# Altium project FMC_SDR_XFE.PrjPcb (part 2 of 3)

## Sheet LTM8056.SchDoc: FMC SDR Frontend
size 420 x 297 mm; CheckedBy: -; CompanyName: CERN; DrawnBy: DrawnBy; Organization: CERN; Address1: European Organization for Nuclear Research; Address2: CH-1211 Genčve 23 - Switzerland; Revision: -; SheetNumber: -; SheetTotal: -; EDA_Number: EDA-XXXXX-VX-X; Projet: -; ModifiedBy: -; CreateDate: XX/XX/XXXX; CheckedDate: -; Title2: PA Main Switching Regulator; DivGrp: TE/MPE; Designer: Designer; ModifiedDate: -
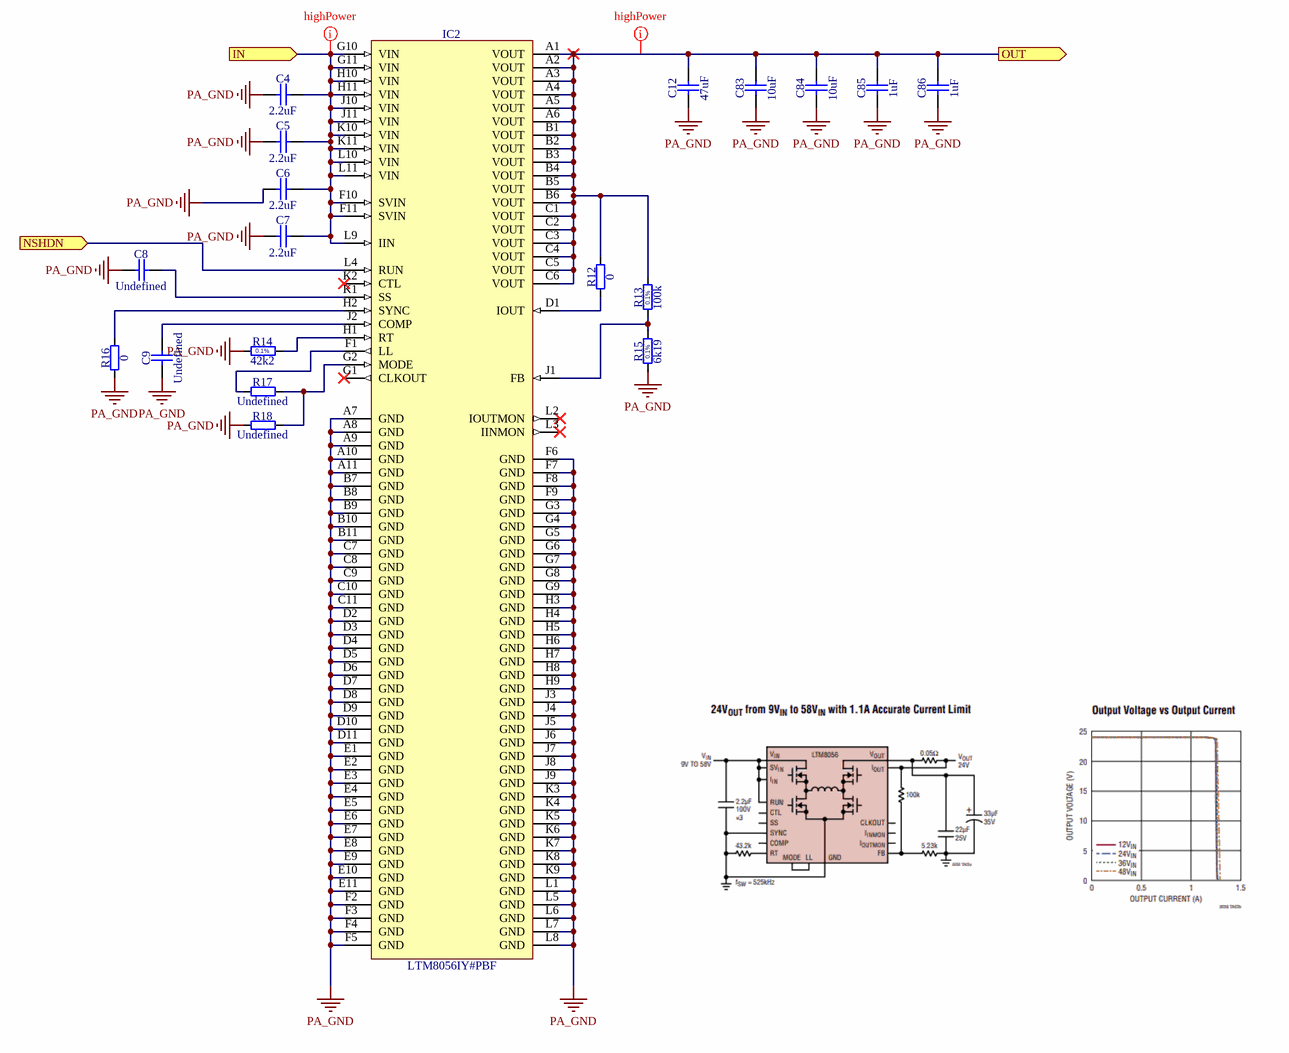
[diagram p2: LTM8056.SchDoc]

### Parts
C4  2.2uF  [CAPC3216X180N]
C5  2.2uF  [CAPC3216X180N]
C6  2.2uF  [CAPC3216X180N]
C7  2.2uF  [CAPC3216X180N]
C8  Undefined  [CAPC1608X90N]
C9  Undefined  [CAPC1608X90N]
C12  47uF  [CAPC_TDK_CKG57N]
C83  10uF  [CAPC3225X280N]
C84  10uF  [CAPC3225X280N]
C85  1uF  [CAPC1608X87N]
C86  1uF  [CAPC1608X87N]
IC2  LTM8056IY#PBF  [BGA121C127P11X11_1500X1500X512]
R12  0  [RESC1608X55N]
R13  100k  [RESC1608X55N]
R14  42k2  [RESC1608X55N]
R15  6k19  [RESC1608X55N]
R16  0  [RESC1608X55N]
R17  Undefined  [RESC1608X55N]
R18  Undefined  [RESC1608X55N]

### Ports
IN (in), NSHDN (in), OUT (out)

### Nets
PA_GND: C4.1 C5.1 C6.1 C7.1 C8.1 C9.1 C12.1 C83.1 C84.1 C85.1 C86.1 IC2.A7(GND) IC2.A8(GND) IC2.A9(GND) IC2.A10(GND) IC2.A11(GND) IC2.B7(GND) IC2.B8(GND) IC2.B9(GND) IC2.B10(GND) IC2.B11(GND) IC2.C7(GND) IC2.C8(GND) IC2.C9(GND) IC2.C10(GND) IC2.C11(GND) IC2.D2(GND) IC2.D3(GND) IC2.D4(GND) IC2.D5(GND) IC2.D6(GND) IC2.D7(GND) IC2.D8(GND) IC2.D9(GND) IC2.D10(GND) IC2.D11(GND) IC2.E1(GND) IC2.E2(GND) IC2.E3(GND) IC2.E4(GND) IC2.E5(GND) IC2.E6(GND) IC2.E7(GND) IC2.E8(GND) IC2.E9(GND) IC2.E10(GND) IC2.E11(GND) IC2.F2(GND) IC2.F3(GND) IC2.F4(GND) IC2.F5(GND) IC2.F6(GND) IC2.F7(GND) IC2.F8(GND) IC2.F9(GND) IC2.G3(GND) IC2.G4(GND) IC2.G5(GND) IC2.G6(GND) IC2.G7(GND) IC2.G8(GND) IC2.G9(GND) IC2.H3(GND) IC2.H4(GND) IC2.H5(GND) IC2.H6(GND) IC2.H7(GND) IC2.H8(GND) IC2.H9(GND) IC2.J3(GND) IC2.J4(GND) IC2.J5(GND) IC2.J6(GND) IC2.J7(GND) IC2.J8(GND) IC2.J9(GND) IC2.K3(GND) IC2.K4(GND) IC2.K5(GND) IC2.K6(GND) IC2.K7(GND) IC2.K8(GND) IC2.K9(GND) IC2.L1(GND) IC2.L5(GND) IC2.L6(GND) IC2.L7(GND) IC2.L8(GND) R14.1 R15.1 R16.1 R18.1
PA_PS_IN: C4.2 C5.2 C6.2 C7.2 IC2.F10(SVIN) IC2.F11(SVIN) IC2.G10(VIN) IC2.G11(VIN) IC2.H10(VIN) IC2.H11(VIN) IC2.J10(VIN) IC2.J11(VIN) IC2.K10(VIN) IC2.K11(VIN) IC2.L9(IIN) IC2.L10(VIN) IC2.L11(VIN) ; port IN
NetC8_2: C8.2 IC2.K1(SS)
NetC9_2: C9.2 IC2.J2(COMP)
NetC12_2: C12.2 C83.2 C84.2 C85.2 C86.2 IC2.A1(VOUT) IC2.A2(VOUT) IC2.A3(VOUT) IC2.A4(VOUT) IC2.A5(VOUT) IC2.A6(VOUT) IC2.B1(VOUT) IC2.B2(VOUT) IC2.B3(VOUT) IC2.B4(VOUT) IC2.B5(VOUT) IC2.B6(VOUT) IC2.C1(VOUT) IC2.C2(VOUT) IC2.C3(VOUT) IC2.C4(VOUT) IC2.C5(VOUT) IC2.C6(VOUT) R12.2 R13.2 ; port OUT
NetIC2_D1: IC2.D1(IOUT) R12.1
NetIC2_F1: IC2.F1(LL) R17.1
NetIC2_G2: IC2.G2(MODE) R17.2 R18.2
NetIC2_H1: IC2.H1(RT) R14.2
NetIC2_H2: IC2.H2(SYNC) R16.2
NetIC2_J1: IC2.J1(FB) R13.1 R15.2
NetIC2_L4: IC2.L4(RUN) ; port NSHDN

Not connected (* = marked no-connect by the designer): IC2 G1(CLKOUT)* K2(CTL)* L2(IOUTMON)* L3(IINMON)*

### Layout directives
net class highPower: NetC12_2, PA_PS_IN

### Notes on the sheet
- Project/Equipment
- Document
- Designer
- Drawn by
- Check.by
- File
- Last Mod.
- Print Date
- Sheet
- Size
- A3
- of
- Rev
- (in symbol R0603_6K19_0.1%_0.063W_10PPM) 0.1%
- (in symbol R0603_42K2_0.1%_0.063W_10PPM) 0.1%
- (in symbol R0603_100K_0.1%_0.063W_10PPM) 0.1%

### Library data of the parts
C4-C7 = CC1206_2.2UF_50V_10%_X7R: Non-polarised capacitor; Part Description: SMD Multilayer Chip Ceramic Capacitor; Manufacturer: GENERIC; Manufacturer1 Part Number: C1206C225K5RACTU; Voltage: 50V; TC: X7R; Tolerance: ±10%; Part Number: CC1206_2.2UF_50V_10%_X7R; Component Kind: Standard; Component Type: Standard; Pin Count: 2; Value: 2.2uF; Status: Preferred; Manufacturer Part Number: CC1206_2.2uF_50V_10%_X7R; Case: 1206; Mounted: Yes; Socket: No; SMD: Yes; Sense: No; Manufacturer1 Example: KEMET; Manufacturer1 ComponentHeight: 1.8mm; HelpURL: \\cern.ch\dfs\Applications\Altium\Datasheets\CC1206_X7R_KEMET.pdf; Author: CERN DEM MR; CreateDate: 06.06.2016; LatestRevisionDate: 06.06.2016
C8 C9 = CC0603_NO-VALUE: Non-polarised capacitor; Part Description: Reserved Footprint For 0603(1608) Chip Ceramic Capacitor; Mounted: No; Part Number: CC0603_NO-VALUE; Component Kind: Standard; Component Type: Standard; Pin Count: 2; Value: Undefined; Status: None; Manufacturer: Undefined; Manufacturer Part Number: CC0603_NO-VALUE; Case: 0603; Socket: No; SMD: Yes; Sense: No; Manufacturer1 ComponentHeight: 0.9mm; HelpURL: Undefined; Author: CERN DEM MR; CreateDate: 22.11.2016; LatestRevisionDate: 22.11.2016
C12 = CC2220_47UF_25V_20%_X7S_TDK_CKG57N: Non-polarised capacitor; Part Description: Multilayer Ceramic Chip Capacitor - Stacked Cap, CKG57N Series; Manufacturer: TDK; Manufacturer Part Number: CKG57NX7S1E476M500JH; Voltage: 25V; TC: X7S; Tolerance: ±20%; Part Number: CC2220_47UF_25V_20%_X7S_TDK_CKG57N; Component Kind: Standard; Component Type: Standard; Pin Count: 2; Value: 47uF; Status: None; Case: 2220; Mounted: Yes; Socket: No; SMD: Yes; Sense: No; ComponentHeight: 5.5mm; HelpURL: \\cern.ch\dfs\Applications\Altium\Datasheets\CC2220_X7S_TDK_CKG.pdf; Author: CERN DEM JLC; CreateDate: 21.10.2014; LatestRevisionDate: 18.12.2017
C83 C84 = CC1210_10UF_50V_10%_X7R_YUDEN_UMK325AB7106KMHP: Non-polarised capacitor; Part Description: SMD Multilayer Chip Ceramic Capacitor (High Dielectric Type) for Automotive / Industrial Applications; Manufacturer: TAIYO YUDEN; Voltage: 50V; TC: X7R; Tolerance: ±10%; Part Number: CC1210_10UF_50V_10%_X7R_YUDEN_UMK325AB7106KMHP; Component Kind: Standard; Component Type: Standard; Pin Count: 2; Value: 10uF; Status: Not Recommended; Manufacturer Part Number: UMK325AB7106KMHP; Case: 1210; Mounted: Yes; Socket: No; SMD: Yes; Sense: No; ComponentHeight: 2.8mm; HelpURL: \\cern.ch\dfs\Applications\Altium\Datasheets\CC1210_TAIYO-YUDEN_UMK325AB7106KMHP.pdf; Author: CERN DEM JLC; CreateDate: 30.11.2016; LatestRevisionDate: 30.12.2015
C85 C86 = CC0603_1UF_50V_10%_X5R: Non-polarised capacitor; Part Description: SMD Multilayer Chip Ceramic Capacitor; Manufacturer: GENERIC; Manufacturer1 Part Number: C1608X5R1H105K080; Voltage: 50V; TC: X5R; Tolerance: ±10%; Part Number: CC0603_1UF_50V_10%_X5R; Component Kind: Standard; Component Type: Standard; Pin Count: 2; Value: 1uF; Status: None; Manufacturer Part Number: CC0603_1UF_50V_10%_X5R; Case: 0603; Mounted: Yes; Socket: No; SMD: Yes; Sense: No; Manufacturer1 Example: TDK; Manufacturer1 ComponentHeight: 0.9mm; HelpURL: \\cern.ch\dfs\Applications\Altium\Datasheets\CC0603_X5R_TDK_C.pdf; Author: CERN DEM JMW; CreateDate: 09.11.2015; LatestRevisionDate: 09.11.2015
IC2 = LTM8056IY#PBF: 58VIN, 48VOUT Buck-Boost µModule Regulator; Manufacturer: LINEAR TECHNOLOGY; PressFit: No; Bonding: No; Part Number: LTM8056IY#PBF; Component Kind: Standard; Component Type: Standard; Device: LTM8056IY#PBF; PackageDescription: BGA,1.27mm Pitch, Square;121 Pin, 11 Columns X 11 Rows, 15.00mm X 15.00mm X 5.12mm H; Part Description: 58VIN, 48VOUT Buck-Boost µModule Regulator; Manufacturer Part Number: LTM8056IY#PBF; Pin Count: 121; Case: BGA121; Mounted: Yes; Socket: No; SMD: Yes; Sense: No; ComponentHeight: 5.12mm; HelpURL: \\cern.ch\dfs\Applications\Altium\Datasheets\LTM8056IY#PBF.pdf; Author: CERN DEM JLC; CreateDate: 08.04.2019; LatestRevisionDate: 08.04.2019
R12 R16 = R0603_0R_JUMPER: Resistor; Part Description: 1A (0.05R Max DC Resistance) Zero Ohm Jumper; Manufacturer: GENERIC; Manufacturer1 Part Number: NRC06Z0; PressFit: No; Part Number: R0603_0R_JUMPER; Component Kind: Standard; Component Type: Standard; Pin Count: 2; Value: 0; Status: Preferred; Manufacturer Part Number: R0603_0R_JUMPER; Case: 0603; Mounted: Yes; Sense: No; Socket: No; SMD: Yes; Manufacturer1 Example: NIC COMPONENT; Manufacturer1 ComponentHeight: 0.55mm; HelpURL: \\cern.ch\dfs\Applications\Altium\Datasheets\R0603_NIC_NRC.pdf; Author: CERN DEM JLC; CreateDate: 03.12.2007; LatestRevisionDate: 13.03.2008
R13 = R0603_100K_0.1%_0.063W_10PPM: Resistor - 0.1%; Part Description: Thin Film Chip Resistor; Manufacturer: GENERIC; Manufacturer1 Part Number: RN73C1J100KBTDF; Power: 0.063W; TC: ±10ppm; PressFit: No; Part Number: R0603_100K_0.1%_0.063W_10PPM; Component Kind: Standard; Component Type: Standard; Pin Count: 2; Value: 100k; Status: Not Recommended; Tolerance: ±0.1%; Manufacturer Part Number: R0603_100K_0.1%_0.063W_10PPM; Case: 0603; Mounted: Yes; Sense: No; Socket: No; SMD: Yes; Manufacturer1 Example: TYCO HOLSWORTHY; Manufacturer1 ComponentHeight: 0.55mm; HelpURL: \\cern.ch\dfs\Applications\Altium\Datasheets\R0603_Tyco_RN73.pdf; Author: CERN DEM JLC; CreateDate: 03.12.2007; LatestRevisionDate: 13.03.2008
R14 = R0603_42K2_0.1%_0.063W_10PPM: Resistor - 0.1%; Part Description: Thin Film Chip Resistor; Manufacturer: GENERIC; Manufacturer1 Part Number: RN73C1J42K2BTDF; Power: 0.063W; TC: ±10ppm; PressFit: No; Part Number: R0603_42K2_0.1%_0.063W_10PPM; Component Kind: Standard; Component Type: Standard; Pin Count: 2; Value: 42k2; Status: Not Recommended; Tolerance: ±0.1%; Manufacturer Part Number: R0603_42K2_0.1%_0.063W_10PPM; Case: 0603; Mounted: Yes; Sense: No; Socket: No; SMD: Yes; Manufacturer1 Example: TYCO HOLSWORTHY; Manufacturer1 ComponentHeight: 0.5mm; HelpURL: \\cern.ch\dfs\Applications\Altium\Datasheets\R0603_Tyco_RN73.pdf; Author: CERN DEM JLC; CreateDate: 03.12.2007; LatestRevisionDate: 13.03.2008
R15 = R0603_6K19_0.1%_0.063W_10PPM: Resistor - 0.1%; Part Description: Thin Film Chip Resistor; Manufacturer: GENERIC; Manufacturer1 Part Number: RN73C1J6K19BTDF; Power: 0.063W; TC: ±10ppm; PressFit: No; Part Number: R0603_6K19_0.1%_0.063W_10PPM; Component Kind: Standard; Component Type: Standard; Pin Count: 2; Value: 6k19; Status: Not Recommended; Tolerance: ±0.1%; Manufacturer Part Number: R0603_6K19_0.1%_0.063W_10PPM; Case: 0603; Mounted: Yes; Sense: No; Socket: No; SMD: Yes; Manufacturer1 Example: TYCO HOLSWORTHY; Manufacturer1 ComponentHeight: 0.5mm; HelpURL: \\cern.ch\dfs\Applications\Altium\Datasheets\R0603_Tyco_RN73.pdf; Author: CERN DEM JLC; CreateDate: 03.12.2007; LatestRevisionDate: 13.03.2008
R17 R18 = R0603_NO-VALUE: Resistor; Part Description: Reserved Footprint For a 0603 (1608) Chip Resistor; PressFit: No; Mounted: No; Part Number: R0603_NO-VALUE; Component Kind: Standard; Component Type: Standard; Pin Count: 2; Value: Undefined; Status: None; Manufacturer: Undefined; Manufacturer Part Number: R0603_NO-VALUE; Case: 0603; Sense: No; Socket: No; SMD: Yes; Manufacturer1 Example: Undefined; Manufacturer1 Part Number: Undefined; Manufacturer1 ComponentHeight: Undefined; HelpURL: Undefined; Author: CERN DEM JLC; CreateDate: 03.12.2007; LatestRevisionDate: 13.03.2008

## Sheet LTM8074neg_PA.SchDoc: FMC SDR Frontend
size 420 x 297 mm; CheckedBy: -; CompanyName: CERN; DrawnBy: DrawnBy; Organization: CERN; Address1: European Organization for Nuclear Research; Address2: CH-1211 Genčve 23 - Switzerland; Revision: -; SheetNumber: -; SheetTotal: -; EDA_Number: EDA-XXXXX-VX-X; Projet: -; ModifiedBy: -; CreateDate: XX/XX/XXXX; CheckedDate: -; Title2: LTM874 - negative, PA GND; DivGrp: TE/MPE; Designer: Designer; ModifiedDate: -
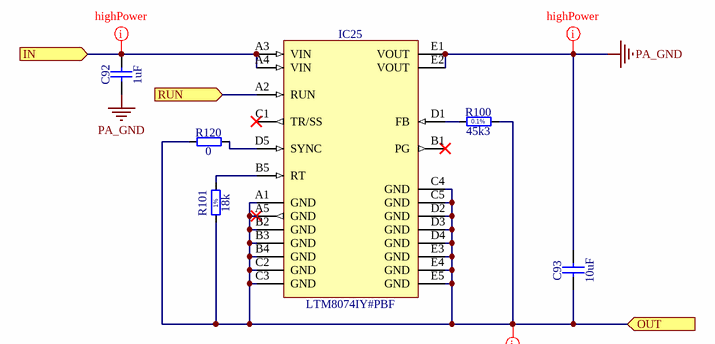
[diagram p3: LTM8074neg_PA.SchDoc]

### Parts
C92  1uF  [CAPC2012X110N]
C93  10uF  [CAPC2012X95N]
IC25  LTM8074IY#PBF  [BGA25C65P5X5_400X400X198]
R100  45k3  [RESC1608X55N]
R101  18k  [RESC1608X55N]
R120  0  [RESC1608X55N]

### Ports
IN (in), OUT (in), RUN (in)

### Nets
FE_PA_-5V: C93.1 IC25.A1(GND) IC25.A5(GND) IC25.B2(GND) IC25.B3(GND) IC25.B4(GND) IC25.C2(GND) IC25.C3(GND) IC25.C4(GND) IC25.C5(GND) IC25.D2(GND) IC25.D3(GND) IC25.D4(GND) IC25.E3(GND) IC25.E4(GND) IC25.E5(GND) R100.2 R101.1 R120.1 ; port OUT
PA_GND: C92.1 C93.2 IC25.E1(VOUT) IC25.E2(VOUT)
PA_PS_5V5: C92.2 IC25.A3(VIN) IC25.A4(VIN) ; port IN
NetIC25_A2: IC25.A2(RUN) ; port RUN
NetIC25_B5: IC25.B5(RT) R101.2
NetIC25_D1: IC25.D1(FB) R100.1
NetIC25_D5: IC25.D5(SYNC) R120.2

Not connected (* = marked no-connect by the designer): IC25 B1(PG)* C1(TR/SS)*

### Layout directives
net class highPower: FE_PA_-5V, PA_GND, PA_PS_5V5

### Notes on the sheet
- Project/Equipment
- Document
- Designer
- Drawn by
- Check.by
- File
- Last Mod.
- Print Date
- Sheet
- Size
- A3
- of
- Rev
- (in symbol R0603_18K_1%_0.1W_100PPM) 1%
- (in symbol R0603_45K3_0.1%_0.063W_10PPM) 0.1%

### Library data of the parts
C92 = CC0805_1UF_50V_10%_X7R: Non-polarised capacitor; Part Description: SMD Multilayer Chip Ceramic Capacitor; Manufacturer: GENERIC; Manufacturer1 Part Number: C0805C105K5RACTU; Voltage: 50V; TC: X7R; Tolerance: ±10%; Part Number: CC0805_1UF_50V_10%_X7R; Component Kind: Standard; Component Type: Standard; Pin Count: 2; Value: 1uF; Status: Preferred; Manufacturer Part Number: CC0805_1UF_50V_10%_X7R; Case: 0805; Mounted: Yes; Socket: No; SMD: Yes; Sense: No; Manufacturer1 Example: KEMET; Manufacturer1 ComponentHeight: 1.1mm; HelpURL: \\cern.ch\dfs\Applications\Altium\Datasheets\CC0805_X7R_KEMET.pdf; Author: CERN DEM JLC; CreateDate: 04.12.2013; LatestRevisionDate: 04.12.2013
C93 = CC0805_10UF_25V_10%_X5R: Non-polarised capacitor; Part Description: SMD Multilayer Chip Ceramic Capacitor; Manufacturer: GENERIC; Manufacturer1 Part Number: GRM219R61E106KA12D; Voltage: 25V; TC: X5R; Tolerance: ±10%; Part Number: CC0805_10UF_25V_10%_X5R; Component Kind: Standard; Component Type: Standard; Pin Count: 2; Value: 10uF; Status: Preferred; Manufacturer Part Number: CC0805_10UF_25V_10%_X5R; Case: 0805; Mounted: Yes; Socket: No; SMD: Yes; Sense: No; Manufacturer1 Example: MURATA; Manufacturer1 ComponentHeight: 0.95mm; HelpURL: \\cern.ch\dfs\Applications\Altium\Datasheets\CC0805_X5R_MURATA_GRM.pdf; Author: CERN DEM JLC; CreateDate: 25.10.2012; LatestRevisionDate: 06.09.2016
IC25 = LTM8074IY#PBF: 40VIN, 1.2A Silent Switcher µModule Regulator; Manufacturer: LINEAR TECHNOLOGY; PressFit: No; Bonding: No; Part Number: LTM8074IY#PBF; Component Kind: Standard; Component Type: Standard; Device: LTM8074IY#PBF; PackageDescription: BGA, 0.65mm Pitch, Square; 25 Pin, 5 Columns X 5 Rows, 4.00mm X 4.00mm X 1.98mm H; Part Description: 40VIN, 1.2A Silent Switcher µModule Regulator; Manufacturer Part Number: LTM8074IY#PBF; Pin Count: 25; Case: BGA25; Mounted: Yes; Socket: No; SMD: Yes; Sense: No; ComponentHeight: 1.98mm; HelpURL: \\cern.ch\dfs\Applications\Altium\Datasheets\LTM8074IY#PBF.pdf; Author: CERN DEM JLC; CreateDate: 08.04.2019; LatestRevisionDate: 08.04.2019
R100 = R0603_45K3_0.1%_0.063W_10PPM: Resistor - 0.1%; Part Description: Thin Film Chip Resistor; Manufacturer: GENERIC; Manufacturer1 Part Number: RN73C1J45K3BTDF; Power: 0.063W; TC: ±10ppm; PressFit: No; Part Number: R0603_45K3_0.1%_0.063W_10PPM; Component Kind: Standard; Component Type: Standard; Pin Count: 2; Value: 45k3; Status: Not Recommended; Tolerance: ±0.1%; Manufacturer Part Number: R0603_45K3_0.1%_0.063W_10PPM; Case: 0603; Mounted: Yes; Sense: No; Socket: No; SMD: Yes; Manufacturer1 Example: TYCO HOLSWORTHY; Manufacturer1 ComponentHeight: 0.5mm; HelpURL: \\cern.ch\dfs\Applications\Altium\Datasheets\R0603_Tyco_RN73.pdf; Author: CERN DEM JLC; CreateDate: 03.12.2007; LatestRevisionDate: 13.03.2008
R101 = R0603_18K_1%_0.1W_100PPM: Resistor - 1%; Part Description: General Purpose Thick Film Chip Resistor; Manufacturer: GENERIC; Manufacturer1 Part Number: NRC06F1802TRF; Power: 0.1W; TC: ±100ppm/°C; PressFit: No; Part Number: R0603_18K_1%_0.1W_100PPM; Component Kind: Standard; Component Type: Standard; Pin Count: 2; Value: 18k; Status: Preferred; Tolerance: ±1%; Manufacturer Part Number: R0603_18K_1%_0.1W_100PPM; Case: 0603; Mounted: Yes; Sense: No; Socket: No; SMD: Yes; Manufacturer1 Example: NIC COMPONENT; Manufacturer1 ComponentHeight: 0.55mm; HelpURL: \\cern.ch\dfs\Applications\Altium\Datasheets\R0603_NIC_NRC.pdf; Author: CERN DEM JLC; CreateDate: 03.12.2007; LatestRevisionDate: 13.03.2008
R120 = R0603_0R_JUMPER: as R12 on sheet LTM8056; Part Number: R0603_0R_JUMPER; Component Kind: Standard; Component Type: Standard; Pin Count: 2; Value: 0; Status: Preferred; Manufacturer Part Number: R0603_0R_JUMPER; Case: 0603; Mounted: Yes; Sense: No; Socket: No; SMD: Yes; Manufacturer1 Example: NIC COMPONENT; Manufacturer1 ComponentHeight: 0.55mm; HelpURL: \\cern.ch\dfs\Applications\Altium\Datasheets\R0603_NIC_NRC.pdf; Author: CERN DEM JLC; CreateDate: 03.12.2007; LatestRevisionDate: 13.03.2008

## Sheet LTM8074neg.SchDoc: FMC SDR Frontend
size 420 x 297 mm; CheckedBy: -; CompanyName: CERN; DrawnBy: DrawnBy; Organization: CERN; Address1: European Organization for Nuclear Research; Address2: CH-1211 Genčve 23 - Switzerland; Revision: -; SheetNumber: -; SheetTotal: -; EDA_Number: EDA-XXXXX-VX-X; Projet: -; ModifiedBy: -; CreateDate: XX/XX/XXXX; CheckedDate: -; Title2: LTM874 - negative; DivGrp: TE/MPE; Designer: Designer; ModifiedDate: -
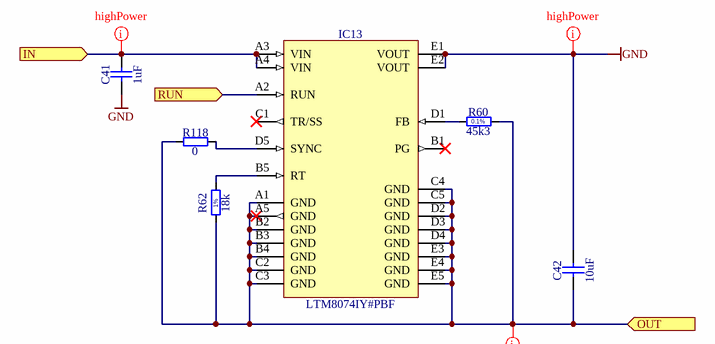
[diagram p4: LTM8074neg.SchDoc]

### Parts
C41  1uF  [CAPC2012X110N]
C42  10uF  [CAPC2012X95N]
IC13  LTM8074IY#PBF  [BGA25C65P5X5_400X400X198]
R60  45k3  [RESC1608X55N]
R62  18k  [RESC1608X55N]
R118  0  [RESC1608X55N]

### Ports
IN (in), OUT (in), RUN (in)

### Nets
FE_5V5: C41.2 IC13.A3(VIN) IC13.A4(VIN) ; port IN
FE_-5V: C42.1 IC13.A1(GND) IC13.A5(GND) IC13.B2(GND) IC13.B3(GND) IC13.B4(GND) IC13.C2(GND) IC13.C3(GND) IC13.C4(GND) IC13.C5(GND) IC13.D2(GND) IC13.D3(GND) IC13.D4(GND) IC13.E3(GND) IC13.E4(GND) IC13.E5(GND) R60.2 R62.1 R118.1 ; port OUT
GND: C41.1 C42.2 IC13.E1(VOUT) IC13.E2(VOUT)
NetIC13_A2: IC13.A2(RUN) ; port RUN
NetIC13_B5: IC13.B5(RT) R62.2
NetIC13_D1: IC13.D1(FB) R60.1
NetIC13_D5: IC13.D5(SYNC) R118.2

Not connected (* = marked no-connect by the designer): IC13 B1(PG)* C1(TR/SS)*

### Layout directives
net class highPower: FE_5V5, FE_-5V, GND

### Notes on the sheet
- Project/Equipment
- Document
- Designer
- Drawn by
- Check.by
- File
- Last Mod.
- Print Date
- Sheet
- Size
- A3
- of
- Rev
- (in symbol R0603_18K_1%_0.1W_100PPM) 1%
- (in symbol R0603_45K3_0.1%_0.063W_10PPM) 0.1%

### Library data of the parts
C41 = CC0805_1UF_50V_10%_X7R: as C92 on sheet LTM8074neg_PA; Part Number: CC0805_1UF_50V_10%_X7R; Component Kind: Standard; Component Type: Standard; Pin Count: 2; Value: 1uF; Status: Preferred; Manufacturer Part Number: CC0805_1UF_50V_10%_X7R; Case: 0805; Mounted: Yes; Socket: No; SMD: Yes; Sense: No; Manufacturer1 Example: KEMET; Manufacturer1 ComponentHeight: 1.1mm; HelpURL: \\cern.ch\dfs\Applications\Altium\Datasheets\CC0805_X7R_KEMET.pdf; Author: CERN DEM JLC; CreateDate: 04.12.2013; LatestRevisionDate: 04.12.2013
C42 = CC0805_10UF_25V_10%_X5R: as C93 on sheet LTM8074neg_PA; Part Number: CC0805_10UF_25V_10%_X5R; Component Kind: Standard; Component Type: Standard; Pin Count: 2; Value: 10uF; Status: Preferred; Manufacturer Part Number: CC0805_10UF_25V_10%_X5R; Case: 0805; Mounted: Yes; Socket: No; SMD: Yes; Sense: No; Manufacturer1 Example: MURATA; Manufacturer1 ComponentHeight: 0.95mm; HelpURL: \\cern.ch\dfs\Applications\Altium\Datasheets\CC0805_X5R_MURATA_GRM.pdf; Author: CERN DEM JLC; CreateDate: 25.10.2012; LatestRevisionDate: 06.09.2016
IC13 = LTM8074IY#PBF: as IC25 on sheet LTM8074neg_PA; Part Number: LTM8074IY#PBF; Component Kind: Standard; Component Type: Standard; Device: LTM8074IY#PBF; PackageDescription: BGA, 0.65mm Pitch, Square; 25 Pin, 5 Columns X 5 Rows, 4.00mm X 4.00mm X 1.98mm H; Part Description: 40VIN, 1.2A Silent Switcher µModule Regulator; Manufacturer Part Number: LTM8074IY#PBF; Pin Count: 25; Case: BGA25; Mounted: Yes; Socket: No; SMD: Yes; Sense: No; ComponentHeight: 1.98mm; HelpURL: \\cern.ch\dfs\Applications\Altium\Datasheets\LTM8074IY#PBF.pdf; Author: CERN DEM JLC; CreateDate: 08.04.2019; LatestRevisionDate: 08.04.2019
R60 = R0603_45K3_0.1%_0.063W_10PPM: as R100 on sheet LTM8074neg_PA; Part Number: R0603_45K3_0.1%_0.063W_10PPM; Component Kind: Standard; Component Type: Standard; Pin Count: 2; Value: 45k3; Status: Not Recommended; Tolerance: ±0.1%; Manufacturer Part Number: R0603_45K3_0.1%_0.063W_10PPM; Case: 0603; Mounted: Yes; Sense: No; Socket: No; SMD: Yes; Manufacturer1 Example: TYCO HOLSWORTHY; Manufacturer1 ComponentHeight: 0.5mm; HelpURL: \\cern.ch\dfs\Applications\Altium\Datasheets\R0603_Tyco_RN73.pdf; Author: CERN DEM JLC; CreateDate: 03.12.2007; LatestRevisionDate: 13.03.2008
R62 = R0603_18K_1%_0.1W_100PPM: as R101 on sheet LTM8074neg_PA; Part Number: R0603_18K_1%_0.1W_100PPM; Component Kind: Standard; Component Type: Standard; Pin Count: 2; Value: 18k; Status: Preferred; Tolerance: ±1%; Manufacturer Part Number: R0603_18K_1%_0.1W_100PPM; Case: 0603; Mounted: Yes; Sense: No; Socket: No; SMD: Yes; Manufacturer1 Example: NIC COMPONENT; Manufacturer1 ComponentHeight: 0.55mm; HelpURL: \\cern.ch\dfs\Applications\Altium\Datasheets\R0603_NIC_NRC.pdf; Author: CERN DEM JLC; CreateDate: 03.12.2007; LatestRevisionDate: 13.03.2008
R118 = R0603_0R_JUMPER: as R12 on sheet LTM8056; Part Number: R0603_0R_JUMPER; Component Kind: Standard; Component Type: Standard; Pin Count: 2; Value: 0; Status: Preferred; Manufacturer Part Number: R0603_0R_JUMPER; Case: 0603; Mounted: Yes; Sense: No; Socket: No; SMD: Yes; Manufacturer1 Example: NIC COMPONENT; Manufacturer1 ComponentHeight: 0.55mm; HelpURL: \\cern.ch\dfs\Applications\Altium\Datasheets\R0603_NIC_NRC.pdf; Author: CERN DEM JLC; CreateDate: 03.12.2007; LatestRevisionDate: 13.03.2008

## Sheet LTM8074_PA.SchDoc: FMC SDR Frontend
size 420 x 297 mm; CheckedBy: -; CompanyName: CERN; DrawnBy: DrawnBy; Organization: CERN; Address1: European Organization for Nuclear Research; Address2: CH-1211 Genčve 23 - Switzerland; Revision: -; SheetNumber: -; SheetTotal: -; EDA_Number: EDA-XXXXX-VX-X; Projet: -; ModifiedBy: -; CreateDate: XX/XX/XXXX; CheckedDate: -; Title2: LTM874 - positive, PA GND; DivGrp: TE/MPE; Designer: Designer; ModifiedDate: -
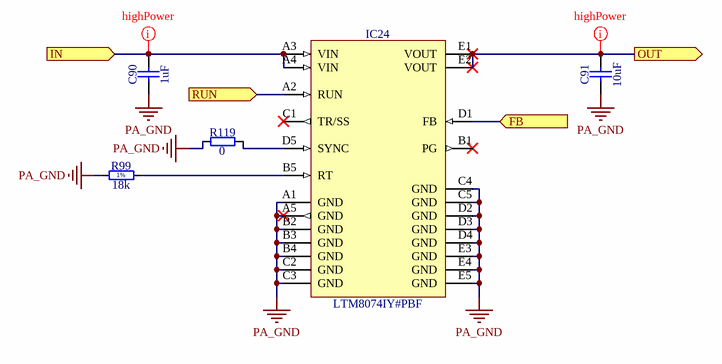
[diagram p5: LTM8074_PA.SchDoc]

### Parts
C90  1uF  [CAPC2012X110N]
C91  10uF  [CAPC2012X95N]
IC24  LTM8074IY#PBF  [BGA25C65P5X5_400X400X198]
R99  18k  [RESC1608X55N]
R119  0  [RESC1608X55N]

### Ports
FB (in), IN (in), OUT (out), RUN (in)

### Nets
BUCKBOOST_OUT: C90.2 IC24.A2(RUN) IC24.A3(VIN) IC24.A4(VIN) ; port IN, port RUN
PA_GND: C90.1 C91.1 IC24.A1(GND) IC24.A5(GND) IC24.B2(GND) IC24.B3(GND) IC24.B4(GND) IC24.C2(GND) IC24.C3(GND) IC24.C4(GND) IC24.C5(GND) IC24.D2(GND) IC24.D3(GND) IC24.D4(GND) IC24.E3(GND) IC24.E4(GND) IC24.E5(GND) R99.1 R119.1
NetC91_2: C91.2 IC24.E1(VOUT) IC24.E2(VOUT) ; port OUT
NetIC24_B5: IC24.B5(RT) R99.2
NetIC24_D1: IC24.D1(FB) ; port FB
NetIC24_D5: IC24.D5(SYNC) R119.2

Not connected (* = marked no-connect by the designer): IC24 B1(PG)* C1(TR/SS)*

### Layout directives
net class highPower: BUCKBOOST_OUT, NetC91_2

### Notes on the sheet
- Project/Equipment
- Document
- Designer
- Drawn by
- Check.by
- File
- Last Mod.
- Print Date
- Sheet
- Size
- A3
- of
- Rev
- (in symbol R0603_18K_1%_0.1W_100PPM) 1%

### Library data of the parts
C90 = CC0805_1UF_50V_10%_X7R: as C92 on sheet LTM8074neg_PA; Part Number: CC0805_1UF_50V_10%_X7R; Component Kind: Standard; Component Type: Standard; Pin Count: 2; Value: 1uF; Status: Preferred; Manufacturer Part Number: CC0805_1UF_50V_10%_X7R; Case: 0805; Mounted: Yes; Socket: No; SMD: Yes; Sense: No; Manufacturer1 Example: KEMET; Manufacturer1 ComponentHeight: 1.1mm; HelpURL: \\cern.ch\dfs\Applications\Altium\Datasheets\CC0805_X7R_KEMET.pdf; Author: CERN DEM JLC; CreateDate: 04.12.2013; LatestRevisionDate: 04.12.2013
C91 = CC0805_10UF_25V_10%_X5R: as C93 on sheet LTM8074neg_PA; Part Number: CC0805_10UF_25V_10%_X5R; Component Kind: Standard; Component Type: Standard; Pin Count: 2; Value: 10uF; Status: Preferred; Manufacturer Part Number: CC0805_10UF_25V_10%_X5R; Case: 0805; Mounted: Yes; Socket: No; SMD: Yes; Sense: No; Manufacturer1 Example: MURATA; Manufacturer1 ComponentHeight: 0.95mm; HelpURL: \\cern.ch\dfs\Applications\Altium\Datasheets\CC0805_X5R_MURATA_GRM.pdf; Author: CERN DEM JLC; CreateDate: 25.10.2012; LatestRevisionDate: 06.09.2016
IC24 = LTM8074IY#PBF: as IC25 on sheet LTM8074neg_PA; Part Number: LTM8074IY#PBF; Component Kind: Standard; Component Type: Standard; Device: LTM8074IY#PBF; PackageDescription: BGA, 0.65mm Pitch, Square; 25 Pin, 5 Columns X 5 Rows, 4.00mm X 4.00mm X 1.98mm H; Part Description: 40VIN, 1.2A Silent Switcher µModule Regulator; Manufacturer Part Number: LTM8074IY#PBF; Pin Count: 25; Case: BGA25; Mounted: Yes; Socket: No; SMD: Yes; Sense: No; ComponentHeight: 1.98mm; HelpURL: \\cern.ch\dfs\Applications\Altium\Datasheets\LTM8074IY#PBF.pdf; Author: CERN DEM JLC; CreateDate: 08.04.2019; LatestRevisionDate: 08.04.2019
R99 = R0603_18K_1%_0.1W_100PPM: as R101 on sheet LTM8074neg_PA; Part Number: R0603_18K_1%_0.1W_100PPM; Component Kind: Standard; Component Type: Standard; Pin Count: 2; Value: 18k; Status: Preferred; Tolerance: ±1%; Manufacturer Part Number: R0603_18K_1%_0.1W_100PPM; Case: 0603; Mounted: Yes; Sense: No; Socket: No; SMD: Yes; Manufacturer1 Example: NIC COMPONENT; Manufacturer1 ComponentHeight: 0.55mm; HelpURL: \\cern.ch\dfs\Applications\Altium\Datasheets\R0603_NIC_NRC.pdf; Author: CERN DEM JLC; CreateDate: 03.12.2007; LatestRevisionDate: 13.03.2008
R119 = R0603_0R_JUMPER: as R12 on sheet LTM8056; Part Number: R0603_0R_JUMPER; Component Kind: Standard; Component Type: Standard; Pin Count: 2; Value: 0; Status: Preferred; Manufacturer Part Number: R0603_0R_JUMPER; Case: 0603; Mounted: Yes; Sense: No; Socket: No; SMD: Yes; Manufacturer1 Example: NIC COMPONENT; Manufacturer1 ComponentHeight: 0.55mm; HelpURL: \\cern.ch\dfs\Applications\Altium\Datasheets\R0603_NIC_NRC.pdf; Author: CERN DEM JLC; CreateDate: 03.12.2007; LatestRevisionDate: 13.03.2008

## Sheet LTM8074.SchDoc: FMC SDR Frontend
size 420 x 297 mm; CheckedBy: -; CompanyName: CERN; DrawnBy: DrawnBy; Organization: CERN; Address1: European Organization for Nuclear Research; Address2: CH-1211 Genčve 23 - Switzerland; Revision: -; SheetNumber: -; SheetTotal: -; EDA_Number: EDA-XXXXX-VX-X; Projet: -; ModifiedBy: -; CreateDate: XX/XX/XXXX; CheckedDate: -; Title2: LTM874 - positive; DivGrp: TE/MPE; Designer: Designer; ModifiedDate: -
Used 2 times, as channels FrontEnd_PS/BUCK_5V5, FrontEnd_PS/BUCK_3V8. Parts and nets are listed once, with the designators drawn on the sheet.
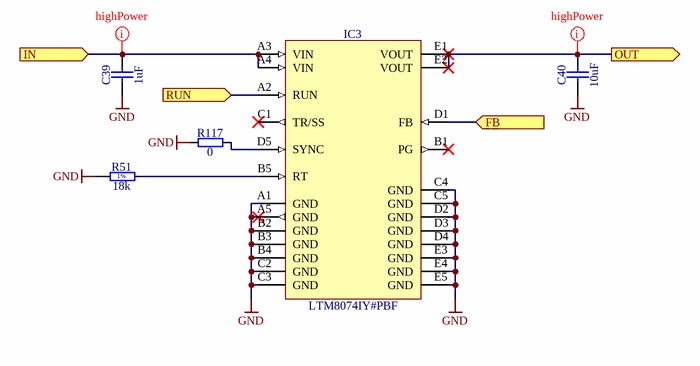
[diagram p6: LTM8074.SchDoc]

### Parts
C39  1uF  [CAPC2012X110N]
C40  10uF  [CAPC2012X95N]
IC3  LTM8074IY#PBF  [BGA25C65P5X5_400X400X198]
R51  18k  [RESC1608X55N]
R117  0  [RESC1608X55N]

### Ports
FB (in), IN (in), OUT (out), RUN (in)

### Nets
GND: C39.1 C40.1 IC3.A1(GND) IC3.A5(GND) IC3.B2(GND) IC3.B3(GND) IC3.B4(GND) IC3.C2(GND) IC3.C3(GND) IC3.C4(GND) IC3.C5(GND) IC3.D2(GND) IC3.D3(GND) IC3.D4(GND) IC3.E3(GND) IC3.E4(GND) IC3.E5(GND) R51.1 R117.1
FB: IC3.D1(FB) ; port FB
IN: C39.2 IC3.A3(VIN) IC3.A4(VIN) ; port IN
OUT: C40.2 IC3.E1(VOUT) IC3.E2(VOUT) ; port OUT
RUN: IC3.A2(RUN) ; port RUN
NetIC3_B5: IC3.B5(RT) R51.2
NetIC3_D5: IC3.D5(SYNC) R117.2

Not connected (* = marked no-connect by the designer): IC3 B1(PG)* C1(TR/SS)*

### Channels
FrontEnd_PS/BUCK_5V5: designators end in _BUCK_5V5; ports FB=NetIC3_BUCK_5V5_D1 IN=NetC39_BUCK_5V5_2 OUT=FE_5V5 RUN=NetC39_BUCK_5V5_2
FrontEnd_PS/BUCK_3V8: designators end in _BUCK_3V8; ports FB=NetIC3_BUCK_3V8_D1 IN=NetC39_BUCK_3V8_2 OUT=NetC40_BUCK_3V8_2 RUN=NetIC3_BUCK_3V8_A2

### Layout directives
net class highPower: FE_5V5, NetC39_BUCK_5V5_2

### Notes on the sheet
- Project/Equipment
- Document
- Designer
- Drawn by
- Check.by
- File
- Last Mod.
- Print Date
- Sheet
- Size
- A3
- of
- Rev
- (in symbol R0603_18K_1%_0.1W_100PPM) 1%

### Library data of the parts
C39 = CC0805_1UF_50V_10%_X7R: as C92 on sheet LTM8074neg_PA; Part Number: CC0805_1UF_50V_10%_X7R; Component Kind: Standard; Component Type: Standard; Pin Count: 2; Value: 1uF; Status: Preferred; Manufacturer Part Number: CC0805_1UF_50V_10%_X7R; Case: 0805; Mounted: Yes; Socket: No; SMD: Yes; Sense: No; Manufacturer1 Example: KEMET; Manufacturer1 ComponentHeight: 1.1mm; HelpURL: \\cern.ch\dfs\Applications\Altium\Datasheets\CC0805_X7R_KEMET.pdf; Author: CERN DEM JLC; CreateDate: 04.12.2013; LatestRevisionDate: 04.12.2013
C40 = CC0805_10UF_25V_10%_X5R: as C93 on sheet LTM8074neg_PA; Part Number: CC0805_10UF_25V_10%_X5R; Component Kind: Standard; Component Type: Standard; Pin Count: 2; Value: 10uF; Status: Preferred; Manufacturer Part Number: CC0805_10UF_25V_10%_X5R; Case: 0805; Mounted: Yes; Socket: No; SMD: Yes; Sense: No; Manufacturer1 Example: MURATA; Manufacturer1 ComponentHeight: 0.95mm; HelpURL: \\cern.ch\dfs\Applications\Altium\Datasheets\CC0805_X5R_MURATA_GRM.pdf; Author: CERN DEM JLC; CreateDate: 25.10.2012; LatestRevisionDate: 06.09.2016
IC3 = LTM8074IY#PBF: as IC25 on sheet LTM8074neg_PA; Part Number: LTM8074IY#PBF; Component Kind: Standard; Component Type: Standard; Device: LTM8074IY#PBF; PackageDescription: BGA, 0.65mm Pitch, Square; 25 Pin, 5 Columns X 5 Rows, 4.00mm X 4.00mm X 1.98mm H; Part Description: 40VIN, 1.2A Silent Switcher µModule Regulator; Manufacturer Part Number: LTM8074IY#PBF; Pin Count: 25; Case: BGA25; Mounted: Yes; Socket: No; SMD: Yes; Sense: No; ComponentHeight: 1.98mm; HelpURL: \\cern.ch\dfs\Applications\Altium\Datasheets\LTM8074IY#PBF.pdf; Author: CERN DEM JLC; CreateDate: 08.04.2019; LatestRevisionDate: 08.04.2019
R51 = R0603_18K_1%_0.1W_100PPM: as R101 on sheet LTM8074neg_PA; Part Number: R0603_18K_1%_0.1W_100PPM; Component Kind: Standard; Component Type: Standard; Pin Count: 2; Value: 18k; Status: Preferred; Tolerance: ±1%; Manufacturer Part Number: R0603_18K_1%_0.1W_100PPM; Case: 0603; Mounted: Yes; Sense: No; Socket: No; SMD: Yes; Manufacturer1 Example: NIC COMPONENT; Manufacturer1 ComponentHeight: 0.55mm; HelpURL: \\cern.ch\dfs\Applications\Altium\Datasheets\R0603_NIC_NRC.pdf; Author: CERN DEM JLC; CreateDate: 03.12.2007; LatestRevisionDate: 13.03.2008
R117 = R0603_0R_JUMPER: as R12 on sheet LTM8056; Part Number: R0603_0R_JUMPER; Component Kind: Standard; Component Type: Standard; Pin Count: 2; Value: 0; Status: Preferred; Manufacturer Part Number: R0603_0R_JUMPER; Case: 0603; Mounted: Yes; Sense: No; Socket: No; SMD: Yes; Manufacturer1 Example: NIC COMPONENT; Manufacturer1 ComponentHeight: 0.55mm; HelpURL: \\cern.ch\dfs\Applications\Altium\Datasheets\R0603_NIC_NRC.pdf; Author: CERN DEM JLC; CreateDate: 03.12.2007; LatestRevisionDate: 13.03.2008

## Sheet LT3080.SchDoc: FMC SDR Frontend
size 420 x 297 mm; CheckedBy: -; CompanyName: CERN; DrawnBy: DrawnBy; Organization: CERN; Address1: European Organization for Nuclear Research; Address2: CH-1211 Genčve 23 - Switzerland; Revision: -; SheetNumber: -; SheetTotal: -; EDA_Number: EDA-XXXXX-VX-X; Projet: -; ModifiedBy: -; CreateDate: XX/XX/XXXX; CheckedDate: -; Title2: PA LDO Regulator; DivGrp: TE/MPE; Designer: Designer; ModifiedDate: -
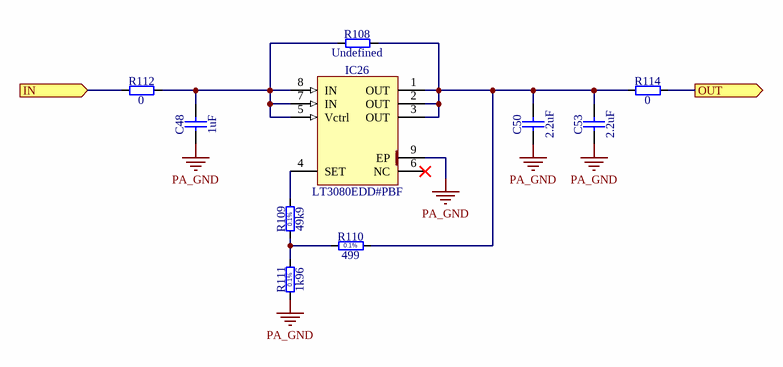
[diagram p7: LT3080.SchDoc]

### Parts
C48  1uF  [CAPC1608X87N]
C50  2.2uF  [CAPC2012X140N]
C53  2.2uF  [CAPC2012X140N]
IC26  LT3080EDD#PBF  [SON50P300X300X80-9N-R175X248]
R108  Undefined  [RESC3216X65N]
R109  49k9  [RESC1608X55N]
R110  499  [RESC1608X55N]
R111  1k96  [RESC1608X55N]
R112  0  [RESC3216X65N]
R114  0  [RESC3216X65N]

### Ports
IN (in), OUT (out)

### Nets
BUCKBOOST_OUT: R112.1 ; port IN
FE_PA_VDD: R114.2 ; port OUT
PA_GND: C48.1 C50.1 C53.1 IC26.9(EP) R111.1
NetC48_2: C48.2 IC26.5(Vctrl) IC26.7(IN) IC26.8(IN) R108.1 R112.2
NetC50_2: C50.2 C53.2 IC26.1(OUT) IC26.2(OUT) IC26.3(OUT) R108.2 R110.2 R114.1
NetIC26_4: IC26.4(SET) R109.2
NetR109_1: R109.1 R110.1 R111.2

Not connected (* = marked no-connect by the designer): IC26 6(NC)*

### Notes on the sheet
- Project/Equipment
- Document
- Designer
- Drawn by
- Check.by
- File
- Last Mod.
- Print Date
- Sheet
- Size
- A3
- of
- Rev
- (in symbol R0603_1K96_0.1%_0.063W_10PPM) 0.1%
- (in symbol R0603_49K9_0.1%_0.063W_10PPM) 0.1%
- (in symbol R0603_499R_0.1%_0.063W_10PPM) 0.1%

### Library data of the parts
C48 = CC0603_1UF_50V_10%_X5R: as C85 on sheet LTM8056; Part Number: CC0603_1UF_50V_10%_X5R; Component Kind: Standard; Component Type: Standard; Pin Count: 2; Value: 1uF; Status: None; Manufacturer Part Number: CC0603_1UF_50V_10%_X5R; Case: 0603; Mounted: Yes; Socket: No; SMD: Yes; Sense: No; Manufacturer1 Example: TDK; Manufacturer1 ComponentHeight: 0.9mm; HelpURL: \\cern.ch\dfs\Applications\Altium\Datasheets\CC0603_X5R_TDK_C.pdf; Author: CERN DEM JMW; CreateDate: 09.11.2015; LatestRevisionDate: 09.11.2015
C50 C53 = CC0805_2.2UF_50V_10%_X7R: Non-polarised capacitor; Part Description: SMD Multilayer Chip Ceramic Capacitor; Manufacturer: GENERIC; Manufacturer1 Part Number: GRM21BR61H225KA73L; Voltage: 50V; TC: X7R; Tolerance: ±10%; Part Number: CC0805_2.2UF_50V_10%_X7R; Component Kind: Standard; Component Type: Standard; Pin Count: 2; Value: 2.2uF; Status: Preferred; Manufacturer Part Number: CC0805_2.2UF_50V_10%_X7R; Case: 0805; Mounted: Yes; Socket: No; SMD: Yes; Sense: No; Manufacturer1 Example: MURATA; Manufacturer1 ComponentHeight: 1.40mm; HelpURL: \\cern.ch\dfs\Applications\Altium\Datasheets\CC0805_X7R_MURATA_GRM.pdf; Author: CERN DEM JLC; CreateDate: 18.08.2014; LatestRevisionDate: 18.08.2014
IC26 = LT3080EDD#PBF: Adjustable 1.1A Single Resistor Low Dropout Regulator; Part Description: 0 To 36V Adjustable 1.1A Single Resistor Low Dropout Regulator; Manufacturer: LINEAR TECHNOLOGY; PressFit: No; Bonding: No; Part Number: LT3080EDD#PBF; Component Kind: Standard; Component Type: Standard; Device: LT3080EDD#PBF; PackageDescription: SON, (DFN) 0.50mm,pitch; 8 pin,3.00mm W X 3.00mm L X 0.80mm H body (w/thermal tab 1.75 X2.48mm), IPC Medium Density; Manufacturer Part Number: LT3080EDD#PBF; Pin Count: 9; Case: SON8; Mounted: Yes; Socket: No; SMD: Yes; Sense: No; ComponentHeight: 0.8mm; HelpURL: \\cern.ch\dfs\Applications\Altium\Datasheets\LT3080EDD#PBF.pdf; Author: CERN DEM JLC; CreateDate: 18.01.2010; LatestRevisionDate: 18.01.2010
R108 = R1206_NO-VALUE: Resistor; Part Description: Reserved Footprint For a 1206 (3216) Chip Resistor; PressFit: No; Mounted: No; Part Number: R1206_NO-VALUE; Component Kind: Standard; Component Type: Standard; Pin Count: 2; Value: Undefined; Status: None; Manufacturer: Undefined; Manufacturer Part Number: R1206_NO-VALUE; Case: 1206; Sense: No; Socket: No; SMD: Yes; Manufacturer1 Example: Undefined; Manufacturer1 Part Number: Undefined; Manufacturer1 ComponentHeight: 0.65mm; HelpURL: Undefined; Author: CERN DEM JLC; CreateDate: 03.12.2007; LatestRevisionDate: 13.03.2008
R109 = R0603_49K9_0.1%_0.063W_10PPM: Resistor - 0.1%; Part Description: Thin Film Chip Resistor; Manufacturer: GENERIC; Manufacturer1 Part Number: RN73C1J49K9BTDF; Power: 0.063W; TC: ±10ppm; PressFit: No; Part Number: R0603_49K9_0.1%_0.063W_10PPM; Component Kind: Standard; Component Type: Standard; Pin Count: 2; Value: 49k9; Status: Not Recommended; Tolerance: ±0.1%; Manufacturer Part Number: R0603_49K9_0.1%_0.063W_10PPM; Case: 0603; Mounted: Yes; Sense: No; Socket: No; SMD: Yes; Manufacturer1 Example: TYCO HOLSWORTHY; Manufacturer1 ComponentHeight: 0.5mm; HelpURL: \\cern.ch\dfs\Applications\Altium\Datasheets\R0603_Tyco_RN73.pdf; Author: CERN DEM JLC; CreateDate: 03.12.2007; LatestRevisionDate: 13.03.2008
R110 = R0603_499R_0.1%_0.063W_10PPM: Resistor - 0.1%; Part Description: Thin Film Chip Resistor; Manufacturer: GENERIC; Manufacturer1 Part Number: RN73C1J499RBTDF; Power: 0.063W; TC: ±10ppm; PressFit: No; Part Number: R0603_499R_0.1%_0.063W_10PPM; Component Kind: Standard; Component Type: Standard; Pin Count: 2; Value: 499; Status: Not Recommended; Tolerance: ±0.1%; Manufacturer Part Number: R0603_499R_0.1%_0.063W_10PPM; Case: 0603; Mounted: Yes; Sense: No; Socket: No; SMD: Yes; Manufacturer1 Example: TYCO HOLSWORTHY; Manufacturer1 ComponentHeight: 0.5mm; HelpURL: \\cern.ch\dfs\Applications\Altium\Datasheets\R0603_Tyco_RN73.pdf; Author: CERN DEM JLC; CreateDate: 03.12.2007; LatestRevisionDate: 13.03.2008
R111 = R0603_1K96_0.1%_0.063W_10PPM: Resistor - 0.1%; Part Description: Thin Film Chip Resistor; Manufacturer: GENERIC; Manufacturer1 Part Number: RN73C1J1K96BTDF; Power: 0.063W; TC: ±10ppm; PressFit: No; Part Number: R0603_1K96_0.1%_0.063W_10PPM; Component Kind: Standard; Component Type: Standard; Pin Count: 2; Value: 1k96; Status: Not Recommended; Tolerance: ±0.1%; Manufacturer Part Number: R0603_1K96_0.1%_0.063W_10PPM; Case: 0603; Mounted: Yes; Sense: No; Socket: No; SMD: Yes; Manufacturer1 Example: TYCO HOLSWORTHY; Manufacturer1 ComponentHeight: 0.5mm; HelpURL: \\cern.ch\dfs\Applications\Altium\Datasheets\R0603_Tyco_RN73.pdf; Author: CERN DEM JLC; CreateDate: 03.12.2007; LatestRevisionDate: 13.03.2008
R112 R114 = R1206_0R_JUMPER: Resistor; Part Description: 2A (0.05R Max DC Resistance) Zero Ohm Jumper; Manufacturer: GENERIC; Manufacturer1 Part Number: NRC12Z0; PressFit: No; Part Number: R1206_0R_JUMPER; Component Kind: Standard; Component Type: Standard; Pin Count: 2; Value: 0; Status: Preferred; Manufacturer Part Number: R1206_0R_JUMPER; Case: 1206; Mounted: Yes; Sense: No; Socket: No; SMD: Yes; Manufacturer1 Example: NIC COMPONENT; Manufacturer1 ComponentHeight: 0.65mm; HelpURL: \\cern.ch\dfs\Applications\Altium\Datasheets\R1206_NIC_NRC.pdf; Author: CERN DEM JLC; CreateDate: 03.12.2007; LatestRevisionDate: 13.03.2008

## Sheet QPA2609.SchDoc: FMC SDR Frontend
size 420 x 297 mm; CheckedBy: -; CompanyName: CERN; DrawnBy: DrawnBy; Organization: CERN; Address1: European Organization for Nuclear Research; Address2: CH-1211 Genčve 23 - Switzerland; Revision: -; SheetNumber: -; SheetTotal: -; EDA_Number: EDA-XXXXX-VX-X; Projet: -; ModifiedBy: -; CreateDate: XX/XX/XXXX; CheckedDate: -; Title2: LNA; DivGrp: TE/MPE; Designer: Designer; ModifiedDate: -
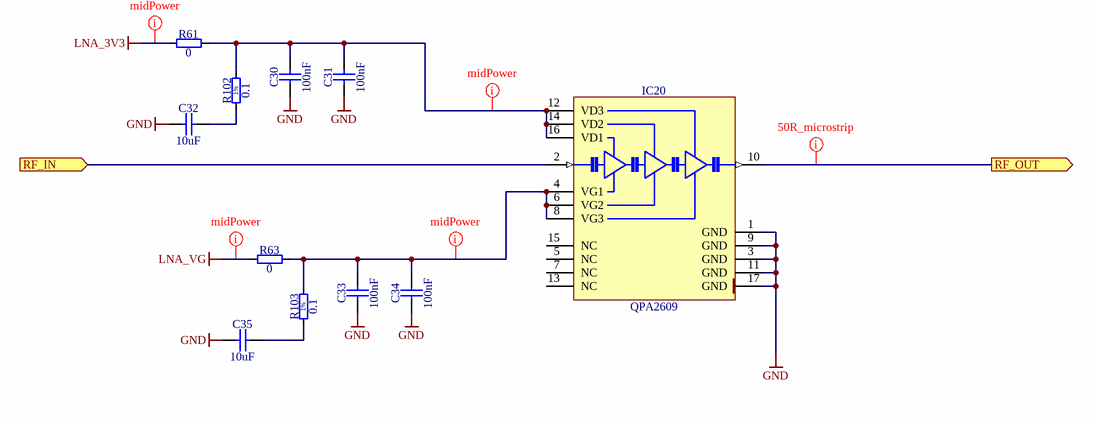
[diagram p8: QPA2609.SchDoc]

### Parts
C30  100nF  [CAPC1005X55N]
C31  100nF  [CAPC1005X55N]
C32  10uF  [CAPC2012X135N]
C33  100nF  [CAPC1005X55N]
C34  100nF  [CAPC1005X55N]
C35  10uF  [CAPC2012X135N]
IC20  QPA2609  [QORVO_QPA2609]
R61  0  [RESC1608X55N]
R63  0  [RESC1608X55N]
R102  0.1  [RESC1005X40N]
R103  0.1  [RESC1005X40N]

### Ports
RF_IN (in), RF_OUT (out)

### Nets
GND: C30.1 C31.1 C32.1 C33.1 C34.1 C35.1 IC20.1(GND) IC20.3(GND) IC20.9(GND) IC20.11(GND) IC20.17(GND)
LNA_3V3: R61.1
LNA_VG: R63.1
NetC30_2: C30.2 C31.2 IC20.12(VD3) IC20.14(VD2) IC20.16(VD1) R61.2 R102.2
NetC32_2: C32.2 R102.1
NetC33_2: C33.2 C34.2 IC20.4(VG1) IC20.6(VG2) IC20.8(VG3) R63.2 R103.2
NetC35_2: C35.2 R103.1
NetFL4_1: IC20.10(RF_OUT) ; port RF_OUT
NetFL6_3: IC20.2(RF_IN) ; port RF_IN

Not connected (* = marked no-connect by the designer): IC20 5(NC) 7(NC) 13(NC) 15(NC)

### Layout directives
net class midPower: LNA_3V3, LNA_VG, NetC30_2, NetC33_2
net class 50R_class: NetFL4_1

### Notes on the sheet
- Project/Equipment
- Document
- Designer
- Drawn by
- Check.by
- File
- Last Mod.
- Print Date
- Sheet
- Size
- A3
- of
- Rev
- (in symbol R0402_0.1R_1%_0.0625W_100PPM) 1%

### Library data of the parts
C30 C31 C33 C34 = CC0402_100NF_16V_10%_X7R: Non-polarised capacitor; Part Description: SMD Multilayer Chip Ceramic Capacitor; Manufacturer: GENERIC; Manufacturer1 Part Number: GRM155R71C104KA88D; Voltage: 16V; TC: X7R; Tolerance: ±10%; Part Number: CC0402_100NF_16V_10%_X7R; Component Kind: Standard; Component Type: Standard; Pin Count: 2; Value: 100nF; Status: Not Recommended; Manufacturer Part Number: CC0402_100NF_16V_10%_X7R; Case: 0402; Mounted: Yes; Socket: No; SMD: Yes; Sense: No; Manufacturer1 Example: MURATA; Manufacturer1 ComponentHeight: 0.55mm; HelpURL: \\cern.ch\dfs\Applications\Altium\Datasheets\CC0402_X7R_MURATA_GRM.pdf; Author: CERN DEM JLC; CreateDate: 05.12.2013; LatestRevisionDate: 03.12.2007
C32 C35 = CC0805_10UF_10V_10%_X7R: Non-polarised capacitor; Part Description: SMD Multilayer Chip Ceramic Capacitor; Manufacturer: GENERIC; Manufacturer1 Part Number: GRM21BR71A106KE51L; Voltage: 10V; TC: X7R; Tolerance: ±10%; Part Number: CC0805_10UF_10V_10%_X7R; Component Kind: Standard; Component Type: Standard; Pin Count: 2; Value: 10uF; Status: Preferred; Manufacturer Part Number: CC0805_10UF_10V_10%_X7R; Case: 0805; Mounted: Yes; Socket: No; SMD: Yes; Sense: No; Manufacturer1 Example: MURATA; Manufacturer1 ComponentHeight: 1.35mm; HelpURL: \\cern.ch\dfs\Applications\Altium\Datasheets\CC0805_X7R_MURATA.pdf; Author: CERN DEM JLC; CreateDate: 30.04.2012; LatestRevisionDate: 30.04.2012
IC20 = QPA2609: 7-14GHz GaAs Low Noise Amplifier; Manufacturer: QORVO; PressFit: No; Bonding: No; Part Number: QPA2609; Component Kind: Standard; Component Type: Standard; Device: QPA2609; PackageDescription: QFN, 0.50mm Pitch, Square; 16 Pin, 4.00mm L X 4.00mm W X 0.9mm H Body (w/thermal Tab 2.75 X 2.75mm); Part Description: 7-14GHz GaAs Low Noise Amplifier; Manufacturer Part Number: QPA2609; Pin Count: 17; Case: QFN16; Mounted: Yes; Socket: No; SMD: Yes; Sense: No; ComponentHeight: 0.9mm; Author: CERN DEM JLC; HelpURL: \\cern.ch\dfs\Applications\Altium\Datasheets\QPA2609.pdf; CreateDate: 01.04.2019; LatestRevisionDate: 01.04.2019
R61 R63 = R0603_0R_JUMPER: as R12 on sheet LTM8056; Part Number: R0603_0R_JUMPER; Component Kind: Standard; Component Type: Standard; Pin Count: 2; Value: 0; Status: Preferred; Manufacturer Part Number: R0603_0R_JUMPER; Case: 0603; Mounted: Yes; Sense: No; Socket: No; SMD: Yes; Manufacturer1 Example: NIC COMPONENT; Manufacturer1 ComponentHeight: 0.55mm; HelpURL: \\cern.ch\dfs\Applications\Altium\Datasheets\R0603_NIC_NRC.pdf; Author: CERN DEM JLC; CreateDate: 03.12.2007; LatestRevisionDate: 13.03.2008
R102 R103 = R0402_0.1R_1%_0.0625W_100PPM: Resistor - 1%; Part Description: General Purpose Thick Film Chip Resistor; Manufacturer: GENERIC; Manufacturer1 Part Number: 232270671007L; TC: ±100ppm/°C; PressFit: No; Part Number: R0402_0.1R_1%_0.0625W_100PPM; Component Kind: Standard; Component Type: Standard; Pin Count: 2; Value: 0.1; Status: Not Recommended; Power: 0.0625W; Tolerance: ±1%; Manufacturer Part Number: R0402_0.1R_1%_0.0625W_100PPM; Case: 0402; Mounted: Yes; Sense: No; Socket: No; SMD: Yes; Manufacturer1 Example: YAGEO PHYCOMP; Manufacturer1 ComponentHeight: 0.4mm; HelpURL: \\cern.ch\dfs\Applications\Altium\Datasheets\R0402_Phycomp_RC0402.pdf; Author: CERN DEM MR; CreateDate: 15.03.2016; LatestRevisionDate: 15.03.2016